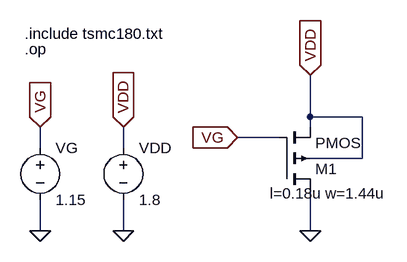
[diagram p0: schematic Pmos_Setup.asc]
Pmos_Setup.asc, the LTspice schematic file:
Version 4
SHEET 1 880 680
WIRE 352 128 352 64
WIRE 432 128 352 128
WIRE 352 144 352 128
WIRE 304 160 240 160
WIRE -64 176 -64 144
WIRE 64 176 64 144
WIRE 432 192 432 128
WIRE 432 192 352 192
WIRE -64 304 -64 256
WIRE 64 304 64 256
WIRE 352 304 352 240
FLAG 352 304 0
FLAG 64 304 0
FLAG -64 304 0
FLAG 64 144 VDD
IOPIN 64 144 In
FLAG 352 64 VDD
IOPIN 352 64 In
FLAG 240 160 VG
IOPIN 240 160 In
FLAG -64 144 VG
IOPIN -64 144 In
SYMBOL pmos4 304 240 M180
WINDOW 123 -14 -6 Left 2
SYMATTR InstName M1
SYMATTR Value2 l=0.18u w=1.44u
SYMBOL voltage 64 160 R0
WINDOW 123 0 0 Left 0
WINDOW 39 0 0 Left 0
SYMATTR InstName VDD
SYMATTR Value 1.8
SYMBOL voltage -64 160 R0
WINDOW 123 0 0 Left 0
WINDOW 39 0 0 Left 0
SYMATTR InstName VG
SYMATTR Value 1.15
TEXT -88 0 Left 2 !.include tsmc180.txt
TEXT -88 24 Left 2 !.op

The netlist it stands for:
* Pmos_Setup.asc
M1 0 VG VDD VDD PMOS l=0.18u w=1.44u
VDD VDD 0 1.8
VG VG 0 1.15
.model NMOS NMOS
.model PMOS PMOS
.lib standard.mos
.include tsmc180.txt
.op
.backanno
.end